# Altium schematic sheet Sheet1.SchDoc
size A4; SheetNumber: 6; SheetTotal: 6
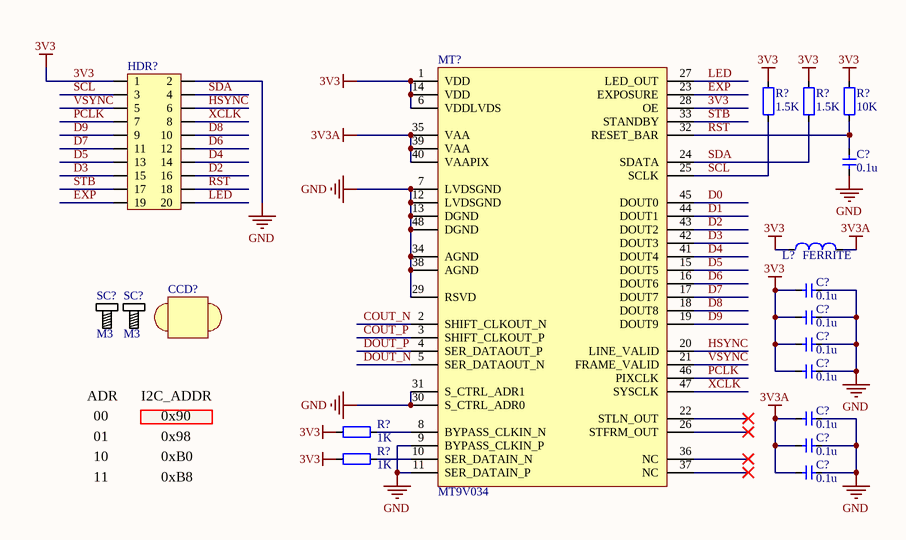
[diagram p0: Sheet1.SchDoc]

## Parts
(Parts that share a designator on the sheet are numbered #1, #2 ... from top to bottom, then left to right.)
C?#1  value 0.1u  [CAP_0603]  (hidden comment: Cap_0603)
C?#2  value 0.1u  [CAP_0603]  (hidden comment: Cap_0603)
C?#3  value 0.1u  [CAP_0402]  (hidden comment: Cap_0402)
C?#4  value 0.1u  [CAP_0603]  (hidden comment: Cap_0603)
C?#5  value 0.1u  [CAP_0603]  (hidden comment: Cap_0603)
C?#6  value 0.1u  [CAP_0603]  (hidden comment: Cap_0603)
C?#7  value 0.1u  [CAP_0603]  (hidden comment: Cap_0603)
C?#8  value 0.1u  [CAP_0603]  (hidden comment: Cap_0603)
CCD?  CCD  [CCD_LENS_20MM]  (value not drawn)
HDR?  HDR2x10_2.54  [HDR2X10_2.54_180]  (value not drawn)
L?  value FERRITE  [IND_0603]  (hidden comment: Ind_0603)
MT?  MT9V034  [CLCC_48]
R?#1  value 1.5K  [RES_0603]  (hidden comment: Res_0603)
R?#2  value 1.5K  [RES_0603]  (hidden comment: Res_0603)
R?#3  value 10K  [RES_0603]  (hidden comment: Res_0603)
R?#4  value 1K  [RES_0603]  (hidden comment: Res_0603)
R?#5  value 1K  [RES_0603]  (hidden comment: Res_0603)
SC?#1  M3  [SCRREW_M3]
SC?#2  M3  [SCRREW_M3]

## Nets
3V3: C?#2.2 C?#3.2 C?#4.2 C?#5.2 HDR?.1 L?.1 MT?.1(VDD) MT?.6(VDDLVDS) MT?.14(VDD) MT?.28(OE) R?#1.2 R?#2.2 R?#3.2 R?#4.2 R?#5.2
3V3A: C?#6.2 C?#7.2 C?#8.2 L?.2 MT?.35(VAA) MT?.39(VAA) MT?.40(VAAPIX)
GND: C?#1.1 C?#2.1 C?#3.1 C?#4.1 C?#5.1 C?#6.1 C?#7.1 C?#8.1 HDR?.2 MT?.7(LVDSGND) MT?.9(BYPASS_CLKIN_P) MT?.11(SER_DATAIN_P) MT?.12(LVDSGND) MT?.13(DGND) MT?.29(RSVD) MT?.30(S_CTRL_ADR0) MT?.31(S_CTRL_ADR1) MT?.34(AGND) MT?.38(AGND) MT?.48(DGND)
COUT_N: MT?.2(SHIFT_CLKOUT_N)
COUT_P: MT?.3(SHIFT_CLKOUT_P)
D0: MT?.45(DOUT0)
D1: MT?.44(DOUT1)
D2: HDR?.16 MT?.43(DOUT2)
D3: HDR?.15 MT?.42(DOUT3)
D4: HDR?.14 MT?.41(DOUT4)
D5: HDR?.13 MT?.15(DOUT5)
D6: HDR?.12 MT?.16(DOUT6)
D7: HDR?.11 MT?.17(DOUT7)
D8: HDR?.10 MT?.18(DOUT8)
D9: HDR?.9 MT?.19(DOUT9)
DOUT_N: MT?.5(SER_DATAOUT_N)
DOUT_P: MT?.4(SER_DATAOUT_P)
EXP: HDR?.19 MT?.23(EXPOSURE)
HSYNC: HDR?.6 MT?.20(LINE_VALID)
LED: HDR?.20 MT?.27(LED_OUT)
PCLK: HDR?.7 MT?.46(PIXCLK)
RST: C?#1.2 HDR?.18 MT?.32(RESET_BAR) R?#3.1
SCL: HDR?.3 MT?.25(SCLK) R?#1.1
SDA: HDR?.4 MT?.24(SDATA) R?#2.1
STB: HDR?.17 MT?.33(STANDBY)
VSYNC: HDR?.5 MT?.21(FRAME_VALID)
XCLK: HDR?.8 MT?.47(SYSCLK)
NetMT?_8: MT?.8(BYPASS_CLKIN_N) R?#4.1
NetMT?_10: MT?.10(SER_DATAIN_N) R?#5.1

Not connected (* = marked no-connect by the designer): MT? 22(STLN_OUT)* 26(STFRM_OUT)* 36(NC)* 37(NC)*

## Notes on the sheet
- ADR
- I2C_ADDR
- 00
- 01
- 10
- 0x98
- 0xB0
- 0x90
- 11
- 0xB8

## Library data of the parts
C?#1 C?#2 C?#4-C?#8 = Cap_0603: Capacitor
C?#3 = Cap_0402: Capacitor
CCD? = lensCCD_20
HDR? = HDR2x10_2.54: Header
L? = Ind_0603: Inductor
MT? = MT9V034: CMOS
R?#1-R?#5 = Res_0603: Resistor
SC?#1 SC?#2 = Screw_M3: Screw